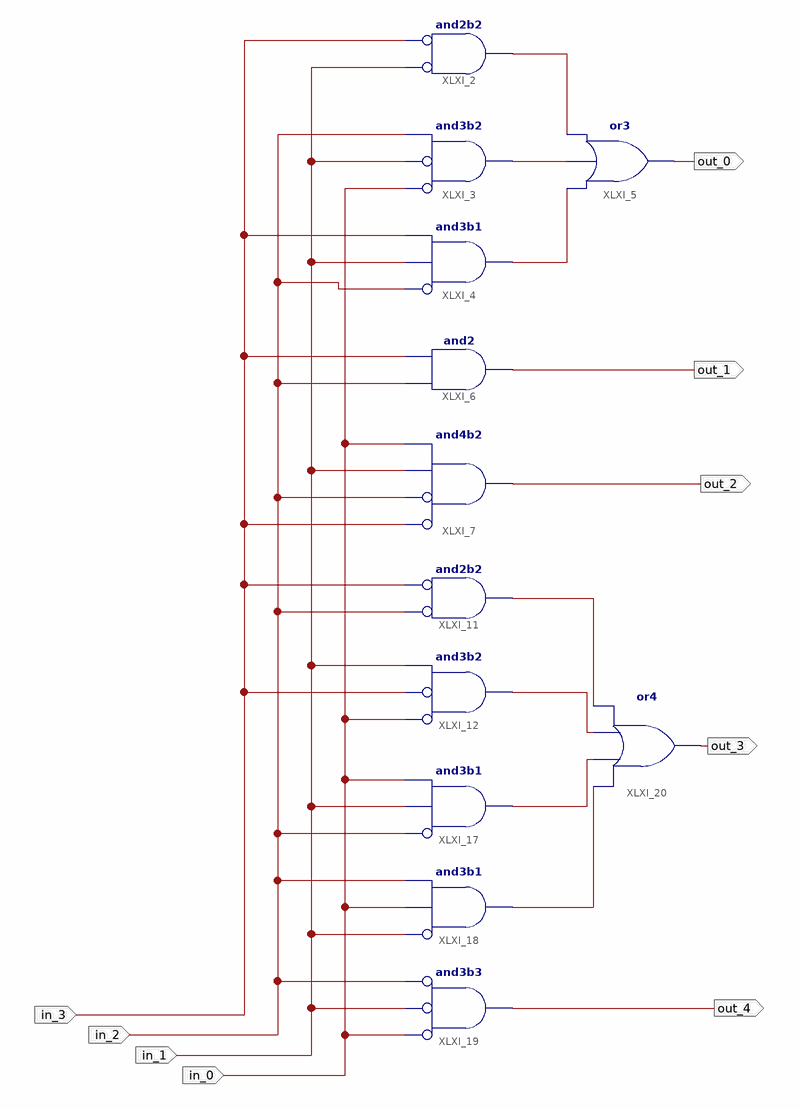
[diagram p0: schematic sheet 1]
// Xilinx ISE schematic lab1.sch (spartan3a) as structural Verilog: 12 symbols, 9 ports
module lab1 (
  input  in_0,
  input  in_2,
  input  in_3,
  input  in_1,
  output out_0,
  output out_1,
  output out_3,
  output out_2,
  output out_4
);

  wire XLXN_12, XLXN_13, XLXN_14, XLXN_15, XLXN_18, XLXN_19, XLXN_20;

  and XLXI_6 (out_1, in_2, in_3);
  and XLXI_7 (out_2, ~in_3, ~in_2, in_1, in_0);  // and4b2
  and XLXI_11 (XLXN_20, ~in_2, ~in_3);  // and2b2
  and XLXI_12 (XLXN_19, ~in_0, ~in_3, in_1);  // and3b2
  and XLXI_2 (XLXN_12, ~in_1, ~in_3);  // and2b2
  and XLXI_3 (XLXN_13, ~in_0, ~in_1, in_2);  // and3b2
  or XLXI_5 (out_0, XLXN_14, XLXN_13, XLXN_12);
  and XLXI_4 (XLXN_14, ~in_2, in_1, in_3);  // and3b1
  and XLXI_17 (XLXN_18, ~in_2, in_1, in_0);  // and3b1
  and XLXI_18 (XLXN_15, ~in_1, in_0, in_2);  // and3b1
  and XLXI_19 (out_4, ~in_0, ~in_1, ~in_2);  // and3b3
  or XLXI_20 (out_3, XLXN_15, XLXN_18, XLXN_19, XLXN_20);
endmodule
